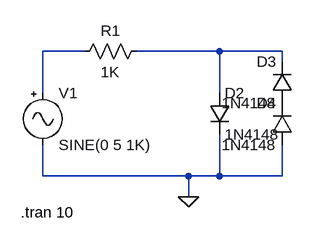
[diagram p0: schematic Draft3.asc]
Draft3.asc, the LTspice schematic file:
Version 4
SHEET 1 880 680
WIRE 112 64 48 64
WIRE 320 64 192 64
WIRE 416 64 320 64
WIRE 416 80 416 64
WIRE 48 128 48 64
WIRE 320 128 320 64
WIRE 48 256 48 208
WIRE 272 256 48 256
WIRE 320 256 320 192
WIRE 320 256 272 256
WIRE 416 256 416 208
WIRE 416 256 320 256
WIRE 272 288 272 256
FLAG 272 288 0
SYMBOL Misc\\signal 48 112 R0
WINDOW 123 0 0 Left 0
WINDOW 39 0 0 Left 0
SYMATTR InstName V1
SYMATTR Value SINE(0 5 1K)
SYMBOL diode 304 128 R0
SYMATTR InstName D2
SYMATTR Value 1N4148
SYMBOL diode 432 144 R180
WINDOW 0 24 64 Left 2
WINDOW 3 24 0 Left 2
SYMATTR InstName D3
SYMATTR Value 1N4148
SYMBOL diode 432 208 R180
WINDOW 0 24 64 Left 2
WINDOW 3 24 0 Left 2
SYMATTR InstName D4
SYMATTR Value 1N4148
SYMBOL res 208 48 R90
WINDOW 0 0 56 VBottom 2
WINDOW 3 32 56 VTop 2
SYMATTR InstName R1
SYMATTR Value 1K
TEXT 14 312 Left 2 !.tran 10

The netlist it stands for:
* Draft3.asc
V1 N001 0 SINE(0 5 1K)
D2 N002 0 1N4148
D3 P001 N002 1N4148
D4 0 P001 1N4148
R1 N002 N001 1K
.model D D
.lib standard.dio
.tran 10
.backanno
.end